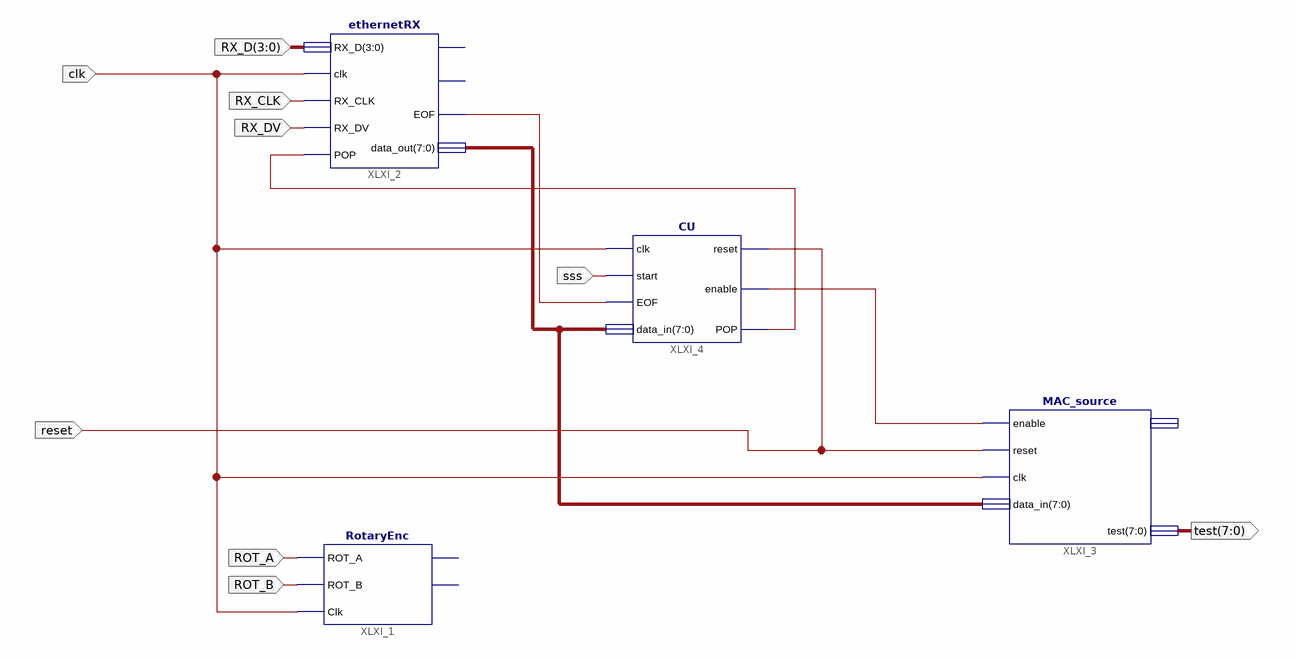
[diagram p0: schematic sheet 1]
// Xilinx ISE schematic test_ekstra.sch (spartan3e) as structural Verilog: 4 symbols, 9 ports
module test_ekstra (
  input  clk,
  input  reset,
  input  ROT_A,
  input  ROT_B,
  input  RX_DV,
  input  RX_CLK,
  input  [3:0] RX_D,
  input  sss,
  output [7:0] test
);

  wire XLXN_3, XLXN_8, XLXN_11;
  wire [7:0] XLXN_2;

  RotaryEnc XLXI_1 (.ROT_A(ROT_A), .ROT_B(ROT_B), .Clk(clk));  // open: RotL, RotR
  ethernetRX XLXI_2 (
    .RX_D(RX_D), .clk(clk), .RX_CLK(RX_CLK), .RX_DV(RX_DV), .POP(XLXN_11), .EOF(XLXN_3), .data_out(XLXN_2));  // open: empty, full
  MAC_source XLXI_3 (.enable(XLXN_8), .reset(reset), .clk(clk), .data_in(XLXN_2), .test(test));  // open: source_MAC
  CU XLXI_4 (.clk(clk), .start(sss), .EOF(XLXN_3), .reset(reset), .data_in(XLXN_2), .enable(XLXN_8), .POP(XLXN_11));
endmodule
